# EAGLE design sensorTensao rev5.5 (EAGLE 8.5.1)
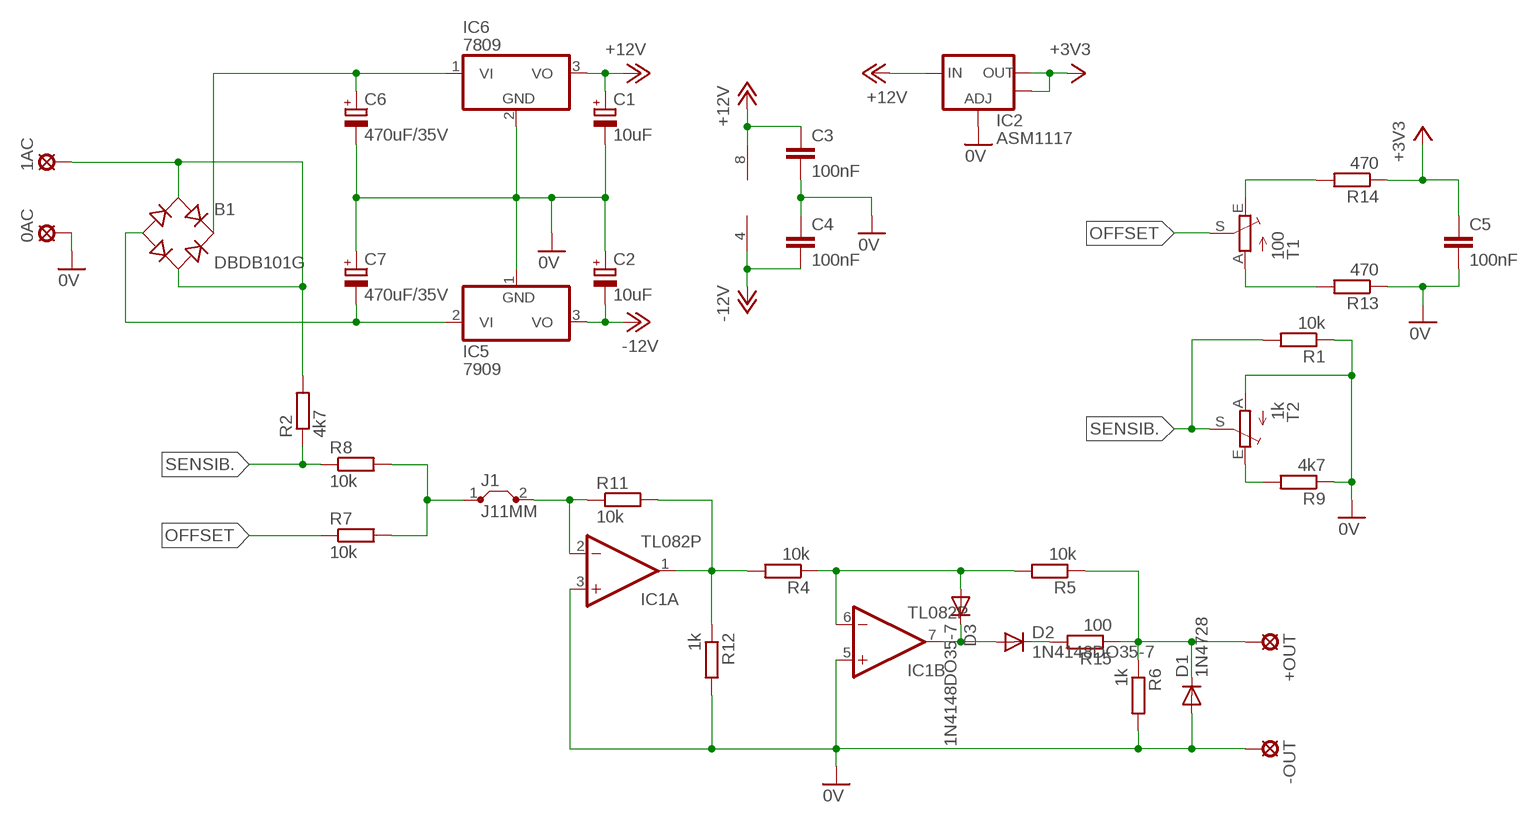
[diagram p0: schematic, sheet 1]

## Parts
0AC  0V  LSP10  [LSP10]
1AC  AC  LSP10  [LSP10]
+OUT  +D  LSP10  [LSP10]
-OUT  0V  LSP10  [LSP10]
B1  DBDB101G  [DB]
C1  10uF  CPOL-EUE2.5-7  [E2,5-7]
C2  10uF  CPOL-EUE2.5-7  [E2,5-7]
C3  100nF  C-EU050-024X044  [C050-024X044]
C4  100nF  C-EU050-024X044  [C050-024X044]
C5  100nF  C-EU050-024X044  [C050-024X044]
C6  470uF/35V  CPOL-EUE3.5-10  [E3,5-10]
C7  470uF/35V  CPOL-EUE3.5-10  [E3,5-10]
D1  1N4728  1N4148DO35-7  [DO35-7]
D2  1N4148DO35-7  [DO35-7]
D3  1N4148DO35-7  [DO35-7]
IC1  TL082P  [DIL08]
IC2  ASM1117  V_REG_LM1117SOT223  [SOT223]
IC5  7909  7912  [TO220V]
IC6  7809  7812TV  [TO220V]
J1  J11MM  [11]
R1  10k  R-EU_0204/7  [0204/7]
R2  4k7  R-EU_0204/7  [0204/7]
R4  10k  R-EU_0204/7  [0204/7]
R5  10k  R-EU_0204/10  [0204/10]
R6  1k  R-EU_0204/7  [0204/7]
R7  10k  R-EU_0204/7  [0204/7]
R8  10k  R-EU_0204/7  [0204/7]
R9  4k7  R-EU_0204/7  [0204/7]
R11  10k  R-EU_0204/7  [0204/7]
R12  1k  R-EU_0204/7  [0204/7]
R13  470  R-EU_0204/7  [0204/7]
R14  470  R-EU_0204/7  [0204/7]
R15  100  R-EU_0204/7  [0204/7]
T1  100  TRIM_EU-CA6V  [CA6V]
T2  1k  TRIM_EU-CA6V  [CA6V]

## Nets
0V: 0AC.MP -OUT.MP C1.- C2.+ C3.2 C4.1 C5.2 C6.- C7.+ D1.A IC1.3(A:+IN) IC1.5(B:+IN) IC2.1(ADJ) IC5.1(GND) IC6.2(GND) R1.1 R6.2 R9.1 R12.2 R13.1 T2.A
+3V3: C5.1 IC2.2(OUT) IC2.4(OUT) R14.1
+12V: C1.+ C3.1 IC1.8(P:V+) IC2.3(IN) IC6.3(VO)
-12V: C2.- C4.2 IC1.4(P:V-) IC5.3(VO)
N$2: B1.+ C6.+ IC6.1(VI)
N$3: 1AC.MP B1.AC1 B1.AC2 R2.2
N$4: R9.2 T2.E
N$6: IC1.2(A:-IN) J1.2 R11.1
N$7: B1.- C7.- IC5.2(VI)
N$8: J1.1 R7.2 R8.2
N$9: R14.2 T1.E
N$10: IC1.1(A:OUT) R4.2 R11.2 R12.1
N$11: D3.A IC1.6(B:-IN) R4.1 R5.2
N$12: +OUT.MP D1.C R5.1 R6.1 R15.1
N$13: R13.2 T1.A
N$14: D2.A D3.C IC1.7(B:OUT)
N$15: D2.C R15.2
OFFSET: R7.1 T1.S
SENSIB.: R1.2 R2.1 R8.1 T2.S

## Library data of the parts
0AC 1AC +OUT -OUT = solpad:LSP10: SOLDER PAD drill 1.0 mm, distributor Buerklin, 12H555
B1 = rectifier:DB?*G: Single Phase 1.0 AMP Glass Passivated Bridge Rectifier Taiwan Semiconductor Co.,Ltd. - TSC Source: http://www.taiwansemi.com/TSCbig5/ezcatfiles/cust/img/img/db101g.pdf http://www.ts.com.tw/db/pictures/modules/PDT/PDT060207001/DBLS201G.pdf
C1 C2 C6 C7 = rcl:CPOL-EU: POLARIZED CAPACITOR, European symbol; SPICEPREFIX: C
C3-C5 = rcl:C-EU: CAPACITOR, European symbol; SPICEPREFIX: C
D1-D3 = diode:1N4148: DIODE high speed (Philips)
IC1 = linear:TL082: OP AMP Data sheet <http://www.ti.com/lit/ds/symlink/tl084a . pdf>; DATA_SHEET: <a href="http://www.ti.com/lit/ds/symlink/tl084a.pdf"> Data sheet </a>
IC2 = SparkFun:V_REG_LM1117: Voltage Regulator LM1117 Standard adjustable voltage regulator but in SMD form. Spark Fun Electronics SKU : COM-00595
IC5 = linear:79*: Negative VOLTAGE REGULATOR
IC6 = linear:78*: Positive VOLTAGE REGULATOR Source: http://cache.national.com/ds/LM/LM78L05.pdf http://www.fairchildsemi.com/ds/LM/LM7805.pdf
J1 = jumper:J: Bridge
R1 R2 R4-R9 R11-R15 = rcl:R-EU_: RESISTOR, European symbol; SPICEPREFIX: R
T1 T2 = pot:TRIM_EU-: POTENTIOMETER

## Net classes
0 default: drill 0.889 mm, clearance 0.635 mm
1 0V: drill 0.889 mm, clearance 0.635 mm
2 +3V3: drill 0.889 mm, clearance 0.635 mm

## Board
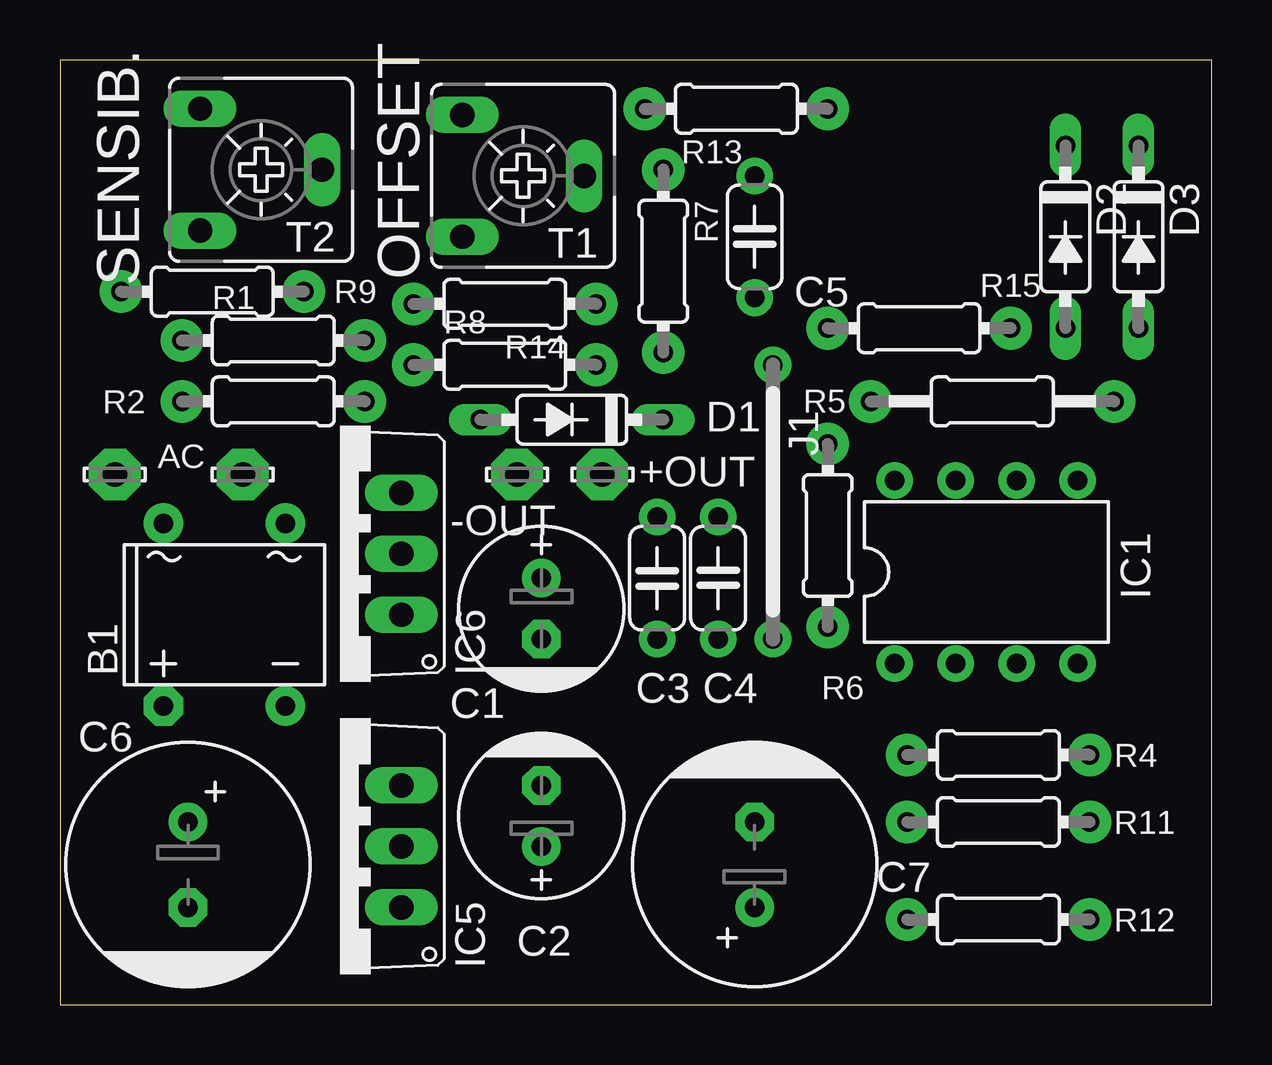
[diagram p1: board, top side]
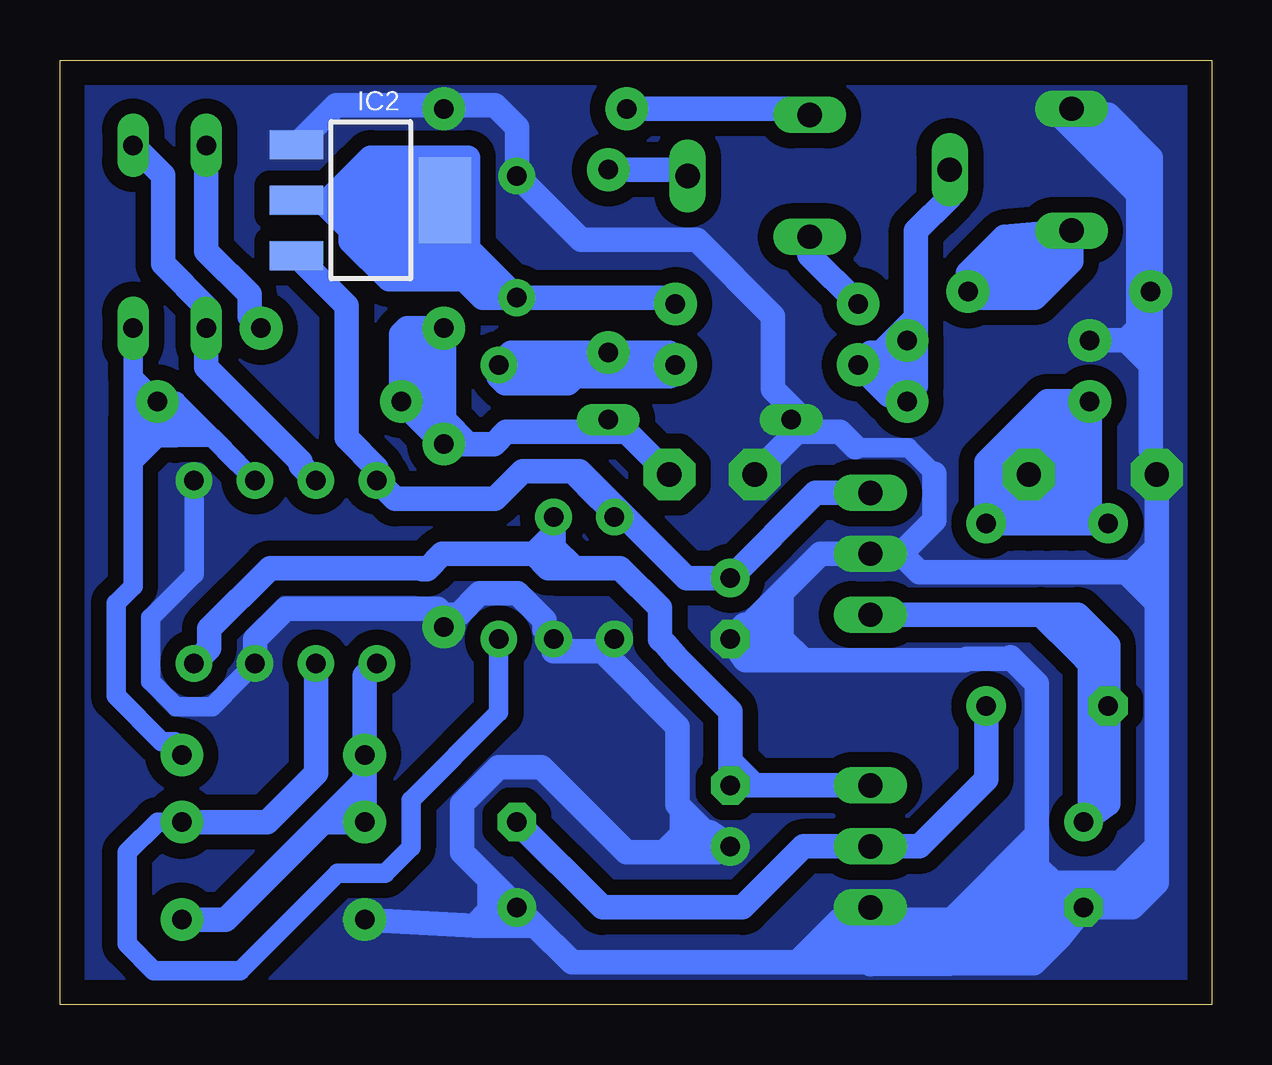
[diagram p2: board, bottom side, seen from below]

Size 48.01 x 39.37 mm. Coordinates in mm from the lower left corner, seen from the top.
Outline: 0,0 48.01,0 48.01,39.37 0,39.37 0,0
Copper layers (1*16): Top 0.035mm / dielectric 1.5mm / Bottom 0.035mm
Design rules "default": minimum track width 6mil, minimum drill 0.35mm, track to track 6mil, track to pad 6mil, pad to pad 6mil, via to via 6mil, smd to smd 6mil, copper to edge 40mil, drill to drill 6mil, minimum pad ring 10mil, minimum via ring 8mil, stop-mask expansion 4mil, vias tented up to drill 0mil, thermal gap 10mil

### Footprints (pad centres in the part's own frame; a part is rotated, then mirrored left to right if it is on the bottom)
LSP10 = drill 1.016 pad 2.159 octagon: MP 0,0
DB = drill 0.813 pad 1.651 octagon: + -2.54,-3.81 | drill 0.813 pad 1.651: - 2.54,-3.81; AC1 2.54,3.81; AC2 -2.54,3.81
E2,5-7 = drill 0.813 pad 1.6: + -1.27,0 | drill 0.813 pad 1.6 octagon: - 1.27,0
C050-024X044 = drill 0.813 pad 1.524: 1 -2.54,0; 2 2.54,0
E3,5-10 = drill 0.813 pad 1.6: + -1.778,0 | drill 0.813 pad 1.6 octagon: - 1.778,0
DO35-7 = drill 0.813 long: A 3.81,0; C -3.81,0
DIL08 = drill 0.813 pad 1.524: 1 -3.81,-3.81; 2 -1.27,-3.81; 3 1.27,-3.81; 4 3.81,-3.81; 5 3.81,3.81; 6 1.27,3.81; 7 -1.27,3.81; 8 -3.81,3.81
SOT223 = smd 1.219 x 2.235: 1 -2.311,-3.099; 2 0,-3.099; 3 2.311,-3.099 | smd 3.6 x 2.2: 4 0,3.099
TO220V = drill 1.016 long: 1 -2.54,-2.54; 2 0,-2.54; 3 2.54,-2.54
11 = drill 0.813 pad 1.524: 1 -5.08,0; 2 6.35,0
0204/7 = drill 0.813 pad 1.778: 1 -3.81,0; 2 3.81,0
0204/10 = drill 0.813 pad 1.778: 1 -5.08,0; 2 5.08,0
CA6V = drill 1.016 long: A -2.54,-2.54; E 2.54,-2.54; S 0,2.54

### Placement (x,y rotation side)
0AC  2.29,22.1 0 top
1AC  7.62,22.1 0 top
+OUT  22.61,22.1 0 top
-OUT  19.05,22.1 0 top
B1  6.86,16.26 0 top
C1  20.07,16.51 270 top
C2  20.07,7.87 90 top
C3  24.89,17.78 270 top
C4  27.43,17.78 90 top
C5  28.96,32 90 top
C6  5.33,5.84 270 top
C7  28.96,5.84 90 top
D1  21.34,24.38 180 top
D2  41.91,32 270 top
D3  44.96,32 270 top
IC1  38.61,18.03 0 top
IC2  35.05,33.53 270 bottom
IC5  11.68,6.6 90 top
IC6  11.68,18.8 90 top
J1  29.72,21.59 270 top
R1  8.89,27.69 0 top
R2  8.89,25.15 180 top
R4  39.12,10.41 180 top
R5  38.86,25.15 0 top
R6  32,19.56 270 top
R7  25.15,30.99 270 top
R8  18.54,26.67 0 top
R9  6.35,29.72 0 top
R11  39.12,7.62 180 top
R12  39.12,3.56 180 top
R13  28.19,37.34 180 top
R14  18.54,29.21 180 top
R15  35.81,28.19 0 top
T1  19.3,34.54 270 top
T2  8.38,34.8 270 top

### Tracks (layer width: path | path; a pad name or v marks a point on that pad's centre or on a via)
0V
  Bottom 0.813: IC1.5 42.42,17.94 44.22,16.14 44.22,13.48 43.16,12.42 41.67,12.42 40.62,13.48 40.62,13.49 IC1.3 | 11.56,22.12 12.65,23.22 14.83,23.22 14.86,23.24
  Bottom 1.016: 5.59,4.06 C6.- | C6.- 3.3,4.06 2.29,5.08 2.29,5.33 | 2.29,5.33 2.29,6.6 | 2.29,6.6 2.29,16.76 | 2.29,16.76 2.29,18.03 | 2.29,18.03 2.29,19.05 | 2.29,19.05 0AC.MP 2.54,23.11 2.54,26.67 | IC1.3 39.88,15.24 38.61,16.51 32.26,16.51 32,16.26 | IC1.3 40.05,14.22 | 6.35,2.79 6.6,2.54 | 6.6,2.54 7.37,1.78 | 28.19,3.3 26.67,1.78 17.27,1.78 | 28.19,3.3 C7.+ | 7.37,1.78 8.38,1.78 | 8.38,1.78 9.91,1.78 | 9.91,1.78 11.25,1.78 | 11.25,1.78 15.75,1.78 | 15.75,1.78 17.27,1.78 | C6.- 5.84,4.32 | 5.84,4.32 6.6,5.08 | 6.6,5.08 7.28,5.75 | 7.28,5.75 7.28,7.11 | 21.12,7.2 20.92,7.2 C2.+ 20.57,6.35 22.35,6.35 | 21.12,7.2 22.07,8.15 | 7.37,5.84 7.28,5.75 | 14.22,1.7 7.41,1.74 7.37,1.78 | 6.35,2.79 C6.- | 11.25,1.78 10.45,2.58 | 10.45,2.58 7.28,5.75 | 9.91,1.78 8.38,3.3 | 8.38,3.3 7.49,4.19 | 7.49,4.19 6.6,5.08 | 5.84,4.32 6.35,3.81 6.35,2.79 | 6.6,5.08 6.6,2.54 | 7.49,4.19 7.49,2.92 7.37,2.79 8.38,1.78 | 8.38,3.3 8.38,1.78 | 6.6,5.08 3.81,5.08 2.29,6.6 | 2.29,5.33 3.3,4.32 4.83,4.32 5.08,4.57 | 2.54,26.67 2.54,27.18 | 2.54,27.18 R9.1 2.54,35.31 4.32,37.08 T2.A 6.35,37.08 3.43,34.16 | 3.43,34.16 3.05,33.78 3.05,28.19 | 3.05,28.19 3.05,27.69 | 3.05,27.69 2.54,27.18 | 3.43,34.16 3.43,34.92 4.83,36.32 | 32,37.49 29.87,37.49 28.96,36.57 C5.2 26.29,31.88 21.46,31.88 18.29,28.7 18.29,25.65 17.65,25.02 | 39.88,14.07 IC1.3 | IC5.1 14.22,1.7 | 14.22,1.7 | 17.27,1.78 15.49,3.56 10.83,3.56 7.28,7.11 | 7.28,7.11 7.28,13.37 8.38,14.48 8.45,14.41 10.21,14.41 10.28,14.35 17.02,14.35 | 12.95,18.8 IC6.2 16.3,18.8 17.93,17.17 | 12.95,18.8 12.19,18.03 3.56,18.03 | 3.3,18.03 2.29,18.03 | 17.02,14.35 18.29,14.35 | 18.29,14.35 19.43,14.35 C1.- 19.47,15.84 19.26,15.84 17.93,17.17 | 3.56,18.03 2.29,16.76
  Bottom 1.016: 3.56,18.03 3.3,18.03 | 3.3,18.03 2.29,19.05 | C7.+ 30.1,5.21 | 30.1,5.21 31.24,6.35 31.24,8.38 29.72,9.91 27.94,9.91 24.38,6.35 22.84,6.35 | 22.84,6.35 22.35,6.35 | 22.35,6.35 22.07,6.63 22.07,7.11 | 22.07,7.11 22.07,8.15 | 22.07,7.11 21.99,7.2 21.12,7.2 | 22.84,6.35 22.07,7.11 | 15.75,1.78 15.75,2.03 14.99,2.79 14.77,2.58 10.45,2.58 | R13.1 32,37.49 | 17.65,25.02 16.51,23.88 | IC2.1 36.5,37.49 32,37.49 | R12.2 30.73,3.3 | 30.73,3.3 29.72,3.3 | 29.72,3.3 C7.+ | 29.72,3.3 28.19,3.3 | 30.73,3.3 30.1,3.94 30.1,5.21 | -OUT.MP 17.65,23.5 | 17.65,23.5 17.27,23.88 16.51,23.88 | 17.65,23.5 17.65,25.02 | 22.07,8.15 22.26,8.34 22.26,11.6 25.4,14.73 | 25.4,14.73 27.43,14.73 C4.1 27.81,15.62 27.81,16.03 28.93,17.14 30.51,17.14 31.4,16.26 32,16.26 | C3.2 25.4,14.73 | R6.2 32,16.26 | 17.02,14.35 17.93,15.26 17.93,17.17 | 18.29,14.35 19.05,15.11 19.05,15.24 18.8,15.24 18.54,15.49 | 14.86,23.24 15.49,23.88 16.51,23.88 | R1.1 3.56,27.69 | 3.56,27.69 3.05,27.69 | 3.56,27.69 3.05,28.19 | 2.54,26.67 3.56,27.69 | 11.56,22.12 11.56,20.19 12.95,18.8
  pour Bottom (no thermals): -1.27,38.86 -1.27,0.25 48.51,0.25 48.51,39.12
+3V3
  Bottom 1.016: 36.83,33.53 IC2.4 | R14.1 22.35,29.46 C5.1 | IC2.4 31.95,33.22 31.45,33.22 31.5,33.17 31.5,32 | IC2.4 31.5,33.98 31.5,34.8 | IC2.2 36.83,33.53 | 36.83,33.53 35.94,32.64 | 35.56,32.26 35.94,32.64 | 35.94,32.64 33.15,32.64 33.02,32.77 | 36.83,33.53 35.56,34.8 | 35.56,34.8 32.51,34.8 32.26,34.54 32.51,34.29 35.31,34.29 | C5.1 29.84,30.35 | 29.84,30.35 30.23,30.73 30.99,31.5 | 30.99,31.5 31.5,32 | IC2.4 33.22,32.26 35.56,32.26 | 35.56,32.26 34.29,30.99 | 34.29,30.99 34.29,30.23 | C5.1 30.4,29.46 31.16,30.23 34.29,30.23 | 34.29,30.23 35.89,31.83 35.89,32.3 36.83,33.24 36.83,33.53 | 34.29,30.99 34.04,30.73 30.99,30.73 | 31.5,32 32,31.5 | 32,31.5 34.04,31.5 | 29.84,30.35 30.86,30.35 32,31.5 | 35.56,34.8 35.05,35.31 30.99,35.31 30.99,31.5
+12V
  Bottom 0.813: C3.1 25.63,21.06 25.63,21.07 26.64,22.08 26.64,22.23
  Bottom 1.016: IC6.3 16.51,21.34 C1.+ 21.89,17.78 26.34,22.23 26.64,22.23 | 25.53,21.11 26.64,22.23 | 26.64,22.23 28.73,22.23 29.87,21.08 34.04,21.08 IC1.8 34.8,22.35 36.07,23.62 36.07,29.13 IC2.3
-12V
  Bottom 1.016: IC1.4 41.78,14.86 41.78,15.67 39.25,18.2 32.95,18.2 32.91,18.16 32.71,18.16 32.07,18.8 28.25,18.8 | 19.05,9.14 C2.- 20.07,10.16 | 19.05,9.14 IC5.3 | 20.07,10.16 20.07,12.24 22.26,14.44 22.77,15.02 22.99,15.24 22.99,16.54 24.65,18.2 26.67,18.2 | 27.43,18.2 26.67,18.2 | 27.43,19.05 C4.2 27.43,19.61 28.25,18.8 | 27.43,19.05 27.43,18.2 | 27.43,19.05 26.67,18.29 26.67,18.2 | 20.07,10.16 19.05,9.14 | 27.43,18.2 27.65,18.2 28.25,18.8
FILL
  pour Bottom: -0.25,40.39 48.26,40.13 48.77,-0.51 -0.76,-0.51
N$2
  Bottom 1.016: 5.46,16.13 5.59,16.26 IC6.1 7.11,16.26 5.59,14.73 | 5.46,16.13 4.32,14.99 4.32,14.73 | 4.32,14.73 B1.+ 4.32,8.38 C6.+ 5.08,7.62 5.08,14.22 5.59,14.73 | 5.59,14.73 5.59,16 5.46,16.13 | 4.32,14.73 5.59,14.73
N$3
  Bottom 1.016: 5.84,20.07 B1.AC2 5.08,20.57 R2.2 | 5.84,20.07 6.86,20.07 | 6.86,20.07 7.62,20.07 | 7.62,20.07 8.38,20.07 | 8.38,20.07 B1.AC1 | 1AC.MP 6,24.96 | 6,24.96 R2.2 | 1AC.MP 7.62,20.83 | 7.62,20.83 7.62,20.07 | 7.62,20.83 8.13,20.32 | 7.62,20.83 7.24,20.45 | 7.24,20.45 6.86,20.07 | B1.AC1 9.4,22.61 6.86,25.15 R2.2 | B1.AC1 8.89,20.83 8.89,22.1 8.13,22.86 1AC.MP | 5.84,20.07 5.84,23.88 | 7.24,20.45 7.24,22.48 5.84,23.88 | 1AC.MP 6.6,21.84 | 6.6,21.84 6.6,20.83 | 6.6,21.84 6.6,22.35 6.35,22.61 7.37,22.61 8.13,21.84 8.13,20.32 | 8.13,20.32 8.38,20.07 | 5.84,23.88 6,24.04 6,24.96 | 1AC.MP 7.62,23.04 6.5,24.16
N$4
  Bottom 1.016: R9.2 7.11,29.72 | 6.35,30.48 5.84,30.99 T2.E 8.64,32 8.89,31.75 | 6.35,30.48 6.35,31.75 6.86,31.75 R9.2 | 6.35,30.48 7.11,29.72 | 7.11,29.72 7.37,29.46 9.4,29.46 | 9.4,29.46 9.65,29.46 | R9.2 10.16,30.48 8.89,31.75 | 8.89,31.75 7.62,31.75 | 9.4,29.46 8.38,30.48 8.38,30.99 8.64,30.99 9.4,30.23 7.37,30.23 7.11,30.48 7.11,30.73
N$6
  Bottom 0.813: J1.2 29.72,12.19 33.38,8.53 33.38,6.57 34.46,5.49 36.42,5.49 40.49,1.42 44.09,1.42 45.21,2.54 45.21,6.35 43.94,7.62 R11.1
  Bottom 1.016: IC1.2 37.34,9.65 39.37,7.62 R11.1
N$7
  Bottom 1.016: C7.- 25.4,4.06 19.56,4.06 17.02,6.6 IC5.2 12.19,6.6 9.4,9.4 B1.-
N$8
  Bottom 1.016: J1.1 28.83,26.8 | 28.83,26.8 28.45,27.18 | 28.45,27.18 R7.2 22.61,27.18 R8.2 22.58,26.19 26.55,26.19 | 26.55,26.19 26.83,25.91 29.46,25.91 29.72,26.16 J1.1 | 26.55,26.19 28.47,26.19 28.83,26.8 | J1.1 29.21,27.18 28.45,27.18
N$9
  Bottom 1.016: R14.2 16.76,31.24 T1.E
N$10
  Bottom 1.016: 35.31,9.35 R11.2 37.03,7.62 | 35.31,9.35 R4.2 35.31,13.72 IC1.1 | R12.1 41.1,3.56 37.03,7.62 | 37.03,7.62 35.31,9.35
N$11
  Bottom 0.813: R4.1 43.23,10.97 43.77,10.97 45.67,12.88 45.67,16.73 44.96,17.45 44.96,22.61 | 44.96,22.61 44.96,23.62 | 44.96,23.62 44.96,24.38 | 44.96,24.38 R5.2 | 41.67,23.65 43.16,23.65 | 43.16,23.65 43.19,23.62 43.94,23.62 | 43.94,23.62 44.96,23.62 | IC1.6 40.62,22.58 40.62,22.59 41.67,23.65 | 43.94,23.62 44.96,22.61 | 43.16,23.65 43.2,23.65 43.81,24.26 | 43.81,24.26 44.45,24.89 | 43.81,24.26 44.83,24.26 44.96,24.38 | 43.81,24.26 43.05,24.26 | 43.05,24.26 42.93,24.13 | 43.05,24.26 R5.2 | 41.67,23.65 43.17,25.15 R5.2 | R5.2 44.96,26.16 D3.A 44.96,24.38
N$12
  Bottom 1.016: 24.38,23.88 +OUT.MP 24.89,24.38 D1.C | 24.38,23.88 D1.C | 30.99,23.37 R6.1 32.77,24.13 | 30.99,23.37 29.92,23.37 29.41,23.88 25.4,23.88 | 25.4,23.88 D1.C | 25.4,23.88 24.38,23.88 | 32.77,24.13 R5.1 33.78,27.94 33.53,28.19 R15.1 32,24.38 30.99,23.37 | 32.77,24.13 32.77,26.16 | 32.77,26.16 32.51,26.42 | 32.77,26.16 33.02,26.42 33.02,27.69
N$13
  Bottom 1.016: T1.A 17.02,37.34 R13.2
N$14
  Bottom 1.016: IC1.7 37.97,22.48 37.97,22.63 41.91,26.57 D2.A 41.91,29.07 43.71,30.87 43.71,34.57 D3.C
N$15
  Bottom 1.016: R15.2 40.11,28.68 40.11,29.6 41.91,31.41 D2.C
OFFSET
  Bottom 1.016: R7.1 22.1,34.8 T1.S
SENSIB.
  Bottom 1.016: 13.21,26.67 R2.1 | 12.32,27.69 12.32,28.64 | 12.32,28.64 12.32,32.26 10.92,33.66 T2.S | R1.2 12.32,27.69 | 13.27,27.69 R1.2 | 13.97,26.67 13.46,26.16 | 13.46,26.16 R2.1 | R1.2 R2.1 | R2.1 12.32,25.78 12.32,27.69 | 12.32,28.64 13.27,27.69 | R8.1 14.22,27.18 13.78,27.18 13.27,27.69 | R8.1 14.22,26.16 13.46,26.16 | R2.1 13.46,25.4 R8.1

### Text on the board
tPlace: AC
tNames: SENSIB. | OFFSET
tValues: + | + | OUT | OUT | AC | 0V | AC | 0V